# Altium project 0927.PrjPcb
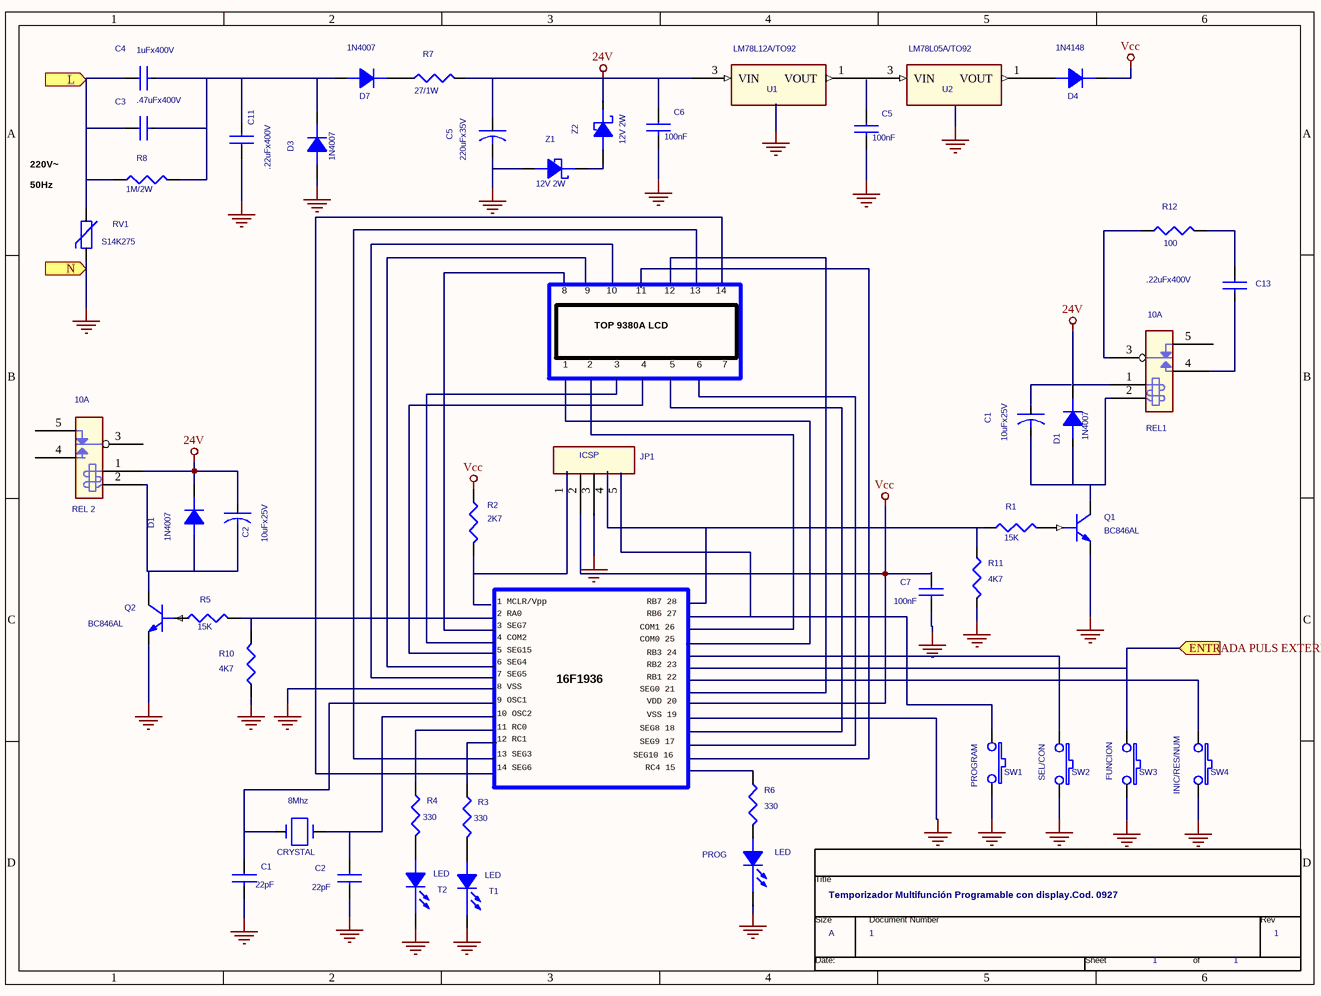
[diagram p0: PAGE1.SchDoc]
1 sheet, 47 parts. Net scope: flat (ports and power ports of the same name join across sheets).

## Sheet PAGE1.SchDoc
size 246 x 182 mm

### Parts
(Parts that share a designator on the sheet are numbered #1, #2 ... from top to bottom, then left to right.)
1N4007#1  D7
1N4007#2  D3
1N4007#3  D1
1N4007#4  D1
1N4148  D4
8Mhz  CRYSTAL
10A#1  REL1
10A#2  REL 2
*  Page Count: 1  Page Size: A  Title: Temporizador Multifunción Programable con display.Cod. 0927  (hidden comment: TitleBlock0)  (graphical)
C1#1  10uFx25V
C1#2  22pF
C2#1  10uFx25V
C2#2  22pF
C3  .47uFx400V
C4  1uFx400V
C5#1  100nF
C5#2  220uFx35V
C6  100nF
C7  100nF
C11  .22uFx400V
C13  .22uFx400V
JP1  ICSP
PROG  LED
Q1  BC846AL
Q2  BC846AL
R1  15K
R2  2K7
R3  330
R4  330
R5  15K
R6  330
R7  27/1W
R8  1M/2W
R10  4K7
R11  4K7
R12  100
RV1  S14K275
SW1  PROGRAM
SW2  SEL/CON
SW3  FUNCION
SW4  INIC/RES/NUM
T1  LED
T2  LED
U1  LM78L12A/TO92
U2  LM78L05A/TO92
Z1  12V 2W
Z2  12V 2W

### Ports
ENTRADA PULS EXTERNO (in), L (in), N (in)

### Nets
24V: 1N4007#3.2(K) 1N4007#4.2(K) 10A#1.1(COIL1) 10A#2.1(COIL1) C2#1.1 C5#2.1 C6.1 R7.2 U1.3(VIN) Z2.1(CATHODE)
GND: 1N4007#2.1(A) C1#2.2 C2#2.2 C5#1.2 C5#2.2 C6.2 C7.2 C11.1 JP1.3 PROG.2(CATHODE) Q1.2(EMITTER) Q2.2(EMITTER) R10.2 R11.2 RV1.2 SW1.2 SW2.2 SW3.2 SW4.2 T1.2(CATHODE) T2.2(CATHODE) U1.2(GND) U2.2(GND) Z1.3(ANODE) ; port N
Vcc: 1N4148.2(K) C7.1 JP1.2 R2.1
Net1N4007#1_1: 1N4007#1.1(A) 1N4007#2.2(K) C3.2 C4.2 C11.2 R8.2
Net1N4007#1_2: 1N4007#1.2(K) R7.1
Net1N4007#3_1: 1N4007#3.1(A) 10A#1.2(COIL2) C1#1.2 Q1.3(COLLECTOR)
Net1N4007#4_1: 1N4007#4.1(A) 10A#2.2(COIL2) C2#1.2 Q2.3(COLLECTOR)
Net1N4148_1: 1N4148.1(A) U2.1(VOUT)
Net8Mhz_1: 8Mhz.1 C1#2.1
Net8Mhz_2: 8Mhz.2 C2#2.1
Net10A#1_3: 10A#1.3(COMMON) R12.1
Net10A#1_4: 10A#1.4(NO) C13.2
NetC3_1: C3.1 C4.1 R8.1 RV1.1 ; port L
NetC13_1: C13.1 R12.2
NetJP1_1: JP1.1 R2.2
NetJP1_4: JP1.4 R1.1 R11.1
NetJP1_5: JP1.5 SW1.1
NetPROG_1: PROG.1(ANODE) R6.2
NetQ1_1: Q1.1(BASE) R1.2
NetQ2_1: Q2.1(BASE) R5.2
NetR3_2: R3.2 T1.1(ANODE)
NetR4_2: R4.2 T2.1(ANODE)
NetR5_1: R5.1 R10.1
NetSW3_1: SW3.1 ; port ENTRADA PULS EXTERNO
NetU1_1: U1.1(VOUT) U2.3(VIN)
NetZ1_1: Z1.1(CATHODE) Z2.3(ANODE)

Not connected (* = marked no-connect by the designer): 10A#1 5(NC); 10A#2 3(COMMON) 4(NO) 5(NC); C1#1 1; C5#1 1; R3 1; R4 1; R6 1; SW2 1; SW4 1

### Notes on the sheet
- 220V~
- (near RV1) 50Hz
- 8
- 9
- TOP 9380A LCD
- 10
- 11
- 12
- 13
- 14
- 1
- 2
- 3
- 4
- 5
- 6
- 7
- 1 MCLR/Vpp
- RB7 28
- 2 RA0
- 3 SEG7
- 4 COM2
- 5 SEG15
- 6 SEG4
- COM1 26
- COM0 25
- RB6 27
- RB3 24
- RB2 23
- 7 SEG5
- 8 VSS
- 9 OSC1
- 10 OSC2
- 11 RC0
- 12 RC1
- 16F1936
- SEG0 21
- SEG8 18
- SEG9 17
- RB1 22
- VDD 20
- VSS 19
- (near R3) 13 SEG3
- (near R3) 14 SEG6
- SEG10 16
- RC4 15
- (in symbol TitleBlock0) Title; Size; Document Number; Rev; Date:; Sheet; of

### Library data of the parts
1N4007#1-1N4007#4 1N4148 = DIODE
10A#1 10A#2 = RELAY SPDT
C1#1 C2#1 C5#2 = C
C1#2 C2#2 C3 C4 C5#1 C6 C7 C11 C13 = CAP NP
JP1 = CON5
R1-R8 R10-R12 = R
RV1 = VARISTOR
SW1-SW4 = SW PUSHBUTTON-SPST/SM
U2 = LM78L12A/TO92
Z1 Z2 = ZC2800E/SOT
* = TitleBlock0: Page Number: 1; RevCode: 1; Doc: 1; Page Create Date: March  8, 1995